# Altium schematic sheet electrode 2.SchDoc
size 254 x 152 mm
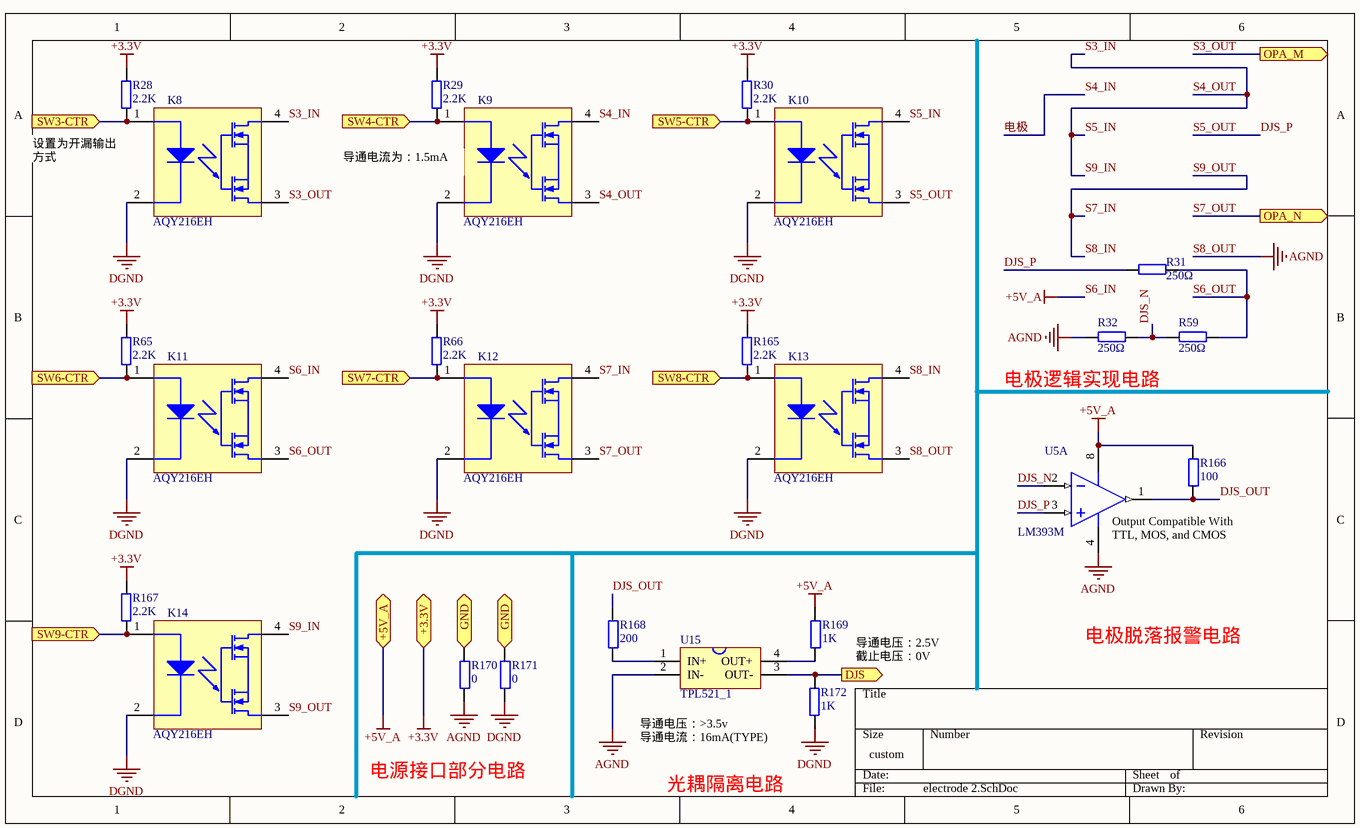
[diagram p0: electrode 2.SchDoc]

## Parts
K8  AQY216EH  [PNSC-DIP4_V]
K9  AQY216EH  [PNSC-DIP4_V]
K10  AQY216EH  [PNSC-DIP4_V]
K11  AQY216EH  [PNSC-DIP4_V]
K12  AQY216EH  [PNSC-DIP4_V]
K13  AQY216EH  [PNSC-DIP4_V]
K14  AQY216EH  [PNSC-DIP4_V]
R28  2.2K  [0603P]
R29  2.2K  [0603P]
R30  2.2K  [0603P]
R31  250Ω  [0603P]
R32  250Ω  [0603P]
R59  250Ω  [0603P]
R65  2.2K  [0603P]
R66  2.2K  [0603P]
R165  2.2K  [0603P]
R166  100  [0603P]
R167  2.2K  [0603P]
R168  200  [0603P]
R169  1K  [0603P]
R170  0  [0603P]
R171  0  [0603P]
R172  1K  [0603P]
U5  LM393M  [M08A_L]  (part A of 2)
U15  TPL521_1

## Ports
+3.3V, +5V_A, DJS (out), GND, OPA_M (out), OPA_N (out), SW3-CTR (in), SW4-CTR (in), SW5-CTR (in), SW6-CTR (in), SW7-CTR (in), SW8-CTR (in), SW9-CTR (in)

## Nets
+3.3V: R28.1 R29.1 R30.1 R65.1 R66.1 R165.1 R167.1 ; port +3.3V
DGND: K8.2 K9.2 K10.2 K11.2 K12.2 K13.2 K14.2 R171.1 R172.2
S6_IN: K11.4 R166.2 R169.2 U5.8(V+) ; port +5V_A  [also labelled +5V_A]
S8_OUT: K13.3 R32.2 R170.1 U5.4(GND) U15.2(IN-)  [also labelled AGND]
DJS: R172.1 U15.3(OUT-) ; port DJS
DJS_N: R32.1 R59.2 U5.2(INA-)
DJS_OUT: R166.1 R168.2 U5.1(OUTA)
DJS_P: K10.3 R31.2 U5.3(INA+)  [also labelled S5_OUT]
GND: R170.2 R171.2 ; port GND
S3_IN: K8.4 K9.3 K10.4 K14.4  [also labelled S4_OUT, S5_IN, S9_IN]
S3_OUT: K8.3 ; port OPA_M
S4_IN: K9.4  [also labelled 电极]
S6_OUT: K11.3 R31.1 R59.1
S7_IN: K12.4 K13.4 K14.3  [also labelled S8_IN, S9_OUT]
S7_OUT: K12.3 ; port OPA_N
SW3-CTR: K8.1 R28.2 ; port SW3-CTR
SW4-CTR: K9.1 R29.2 ; port SW4-CTR
SW5-CTR: K10.1 R30.2 ; port SW5-CTR
SW6-CTR: K11.1 R65.2 ; port SW6-CTR
SW7-CTR: K12.1 R66.2 ; port SW7-CTR
SW8-CTR: K13.1 R165.2 ; port SW8-CTR
SW9-CTR: K14.1 R167.2 ; port SW9-CTR
NetR168_1: R168.1 U15.1(IN+)
NetR169_1: R169.1 U15.4(OUT+)

## Notes on the sheet
- 设置为开漏输出方式
- (near K9) 导通电流为：1.5mA
- (near R32) 电极逻辑实现电路
- (near U5) Output Compatible With TTL, MOS, and CMOS
- 电极脱落报警电路
- 导通电压：2.5V
  截止电压：0V
- 电源接口部分电路
- 导通电压：>3.5v
  导通电流：16mA(TYPE)
- 光耦隔离电路

## Library data of the parts
K8-K14 = AQY216EH: PhotoMOS GE 1 Form A, 600 V Load Voltage, 0.05 A Continuous Load Current, -40 to 85 degC, 4-Pin DIP, Tube, RoHS; Manufacturer: Panasonic; Continuous Load Current: 0.05 A; Load Voltage: 600 V; On Resistance (Typ): 52 Ohm; Pb-Free: True; DatasheetVersion: 201404-T; PackageVersion: ASCTB67E, 04/2014; PackageReference: DIP4; PackageDescription: 4-Pin Through Hole Terminal Package, Body 4.78 x 6.4 mm, Pitch 2.54 mm; Supplier 1: Mouser; Supplier Part Number 1: 769-AQY216EH; Supplier 2: Digi-Key; Supplier Part Number 2: AQY216EH-ND; Packing: Tube; RoHS: True; Series: PhotoMOS GE 1 Form A; Mounting Technology: Through Hole; PartNumber: AQY216EH; ComponentLink1Description: Manufacturer URL; ComponentLink1URL: http://www3.panasonic.biz/ac/ae/index.jsp; ComponentLink2Description: Datasheet; ComponentLink2URL: http://www3.panasonic.biz/ac/e_download/control/relay/photomos/catalog/semi_eng_ge1a_aqy21_e.pdf; ComponentLink3Description: Package Specification; ComponentLink3URL: http://www3.panasonic.biz/ac/e_download/control/relay/photomos/catalog/semi_eng_dimensions.pdf?f_cd=401560
R28-R32 R59 R65 R66 R165-R172 = R
U5 = LM393M: Low Power Low Offset Voltage Dual Comparator, 8-pin Narrow SOIC; Manufacturer: National Semiconductor; PackageTopMarking: NSZXTT*LM*393M; PowerWise: N; CompType: Amplifiers; High-Reliability: Y; DatasheetVersion: Aug-2002; PackageVersion: revM, May-2009; PackageReference: M08A; PackageDescription: SOIC Narrow, 4.9 x 3.9 x 1.45mm, 8 Lead, 1.27mm Pitch; PartNumber: LM393M; RoHS: N; PinCount: 8; Code_JEDEC: MS-012-AA; Code_IPC: SOIC127P600-8; ComponentLink1Description: Manufacturer URL; ComponentLink1URL: http://www.national.com/; ComponentLink2Description: LM393 Datasheet; ComponentLink2URL: http://www.national.com/ds/LM/LM393.pdf; ComponentLink3Description: LM393 Web Page; ComponentLink3URL: http://www.national.com/pf/LM/LM393.html; ComponentLink4Description: M08A Package Page; ComponentLink4URL: http://www.national.com/packaging/folders/m08a.html